# Altium schematic sheet CONNECT_EXP.SchDoc
size 420 x 297 mm
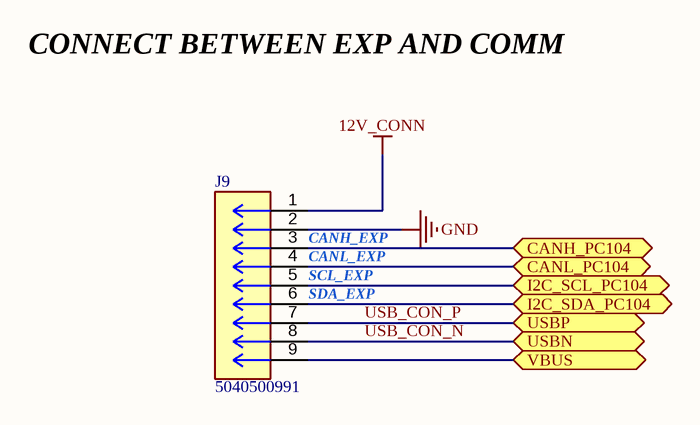
[diagram p0: CONNECT_EXP.SchDoc]

## Parts
J9  5040500991  [5040500991]

## Ports
CANH_PC104 (bidir), CANL_PC104 (bidir), I2C_SCL_PC104 (bidir), I2C_SDA_PC104 (bidir), USBN (bidir), USBP (bidir), VBUS (bidir)

## Nets
12V_CONN: J9.1
GND: J9.2
CANH_PC104: J9.3 ; port CANH_PC104
CANL_PC104: J9.4 ; port CANL_PC104
I2C_SCL_PC104: J9.5 ; port I2C_SCL_PC104
I2C_SDA_PC104: J9.6 ; port I2C_SDA_PC104
USB_CON_N: J9.8 ; port USBN
USB_CON_P: J9.7 ; port USBP
VBUS: J9.9 ; port VBUS

## Notes on the sheet
- CONNECT BETWEEN EXP AND COMM
- (near J9) CANL_EXP
- (near J9) CANH_EXP
- (near J9) SCL_EXP
- (near J9) SDA_EXP
- Sub-system:
- Design by:
- Sheet title:
- Project:
- Sheet:
- of
- Checked by:
- Approved by:
- Doc no:
- Revision:
- Size:
- Date:

## Library data of the parts
J9 = 5040500991: Connector Header Surface Mount, Right Angle 9 position 0.059" (1.50mm)